# Altium schematic sheet Sheet1.SchDoc: Air Monitor - Draft-1
size 431 x 279 mm; CompanyName: Indian Institute of Technology Hyderabad; DrawnBy: Team; DocumentNumber: 1; Revision: V1; SheetNumber: 1; SheetTotal: 1; Application_BuildNumber: Rev1
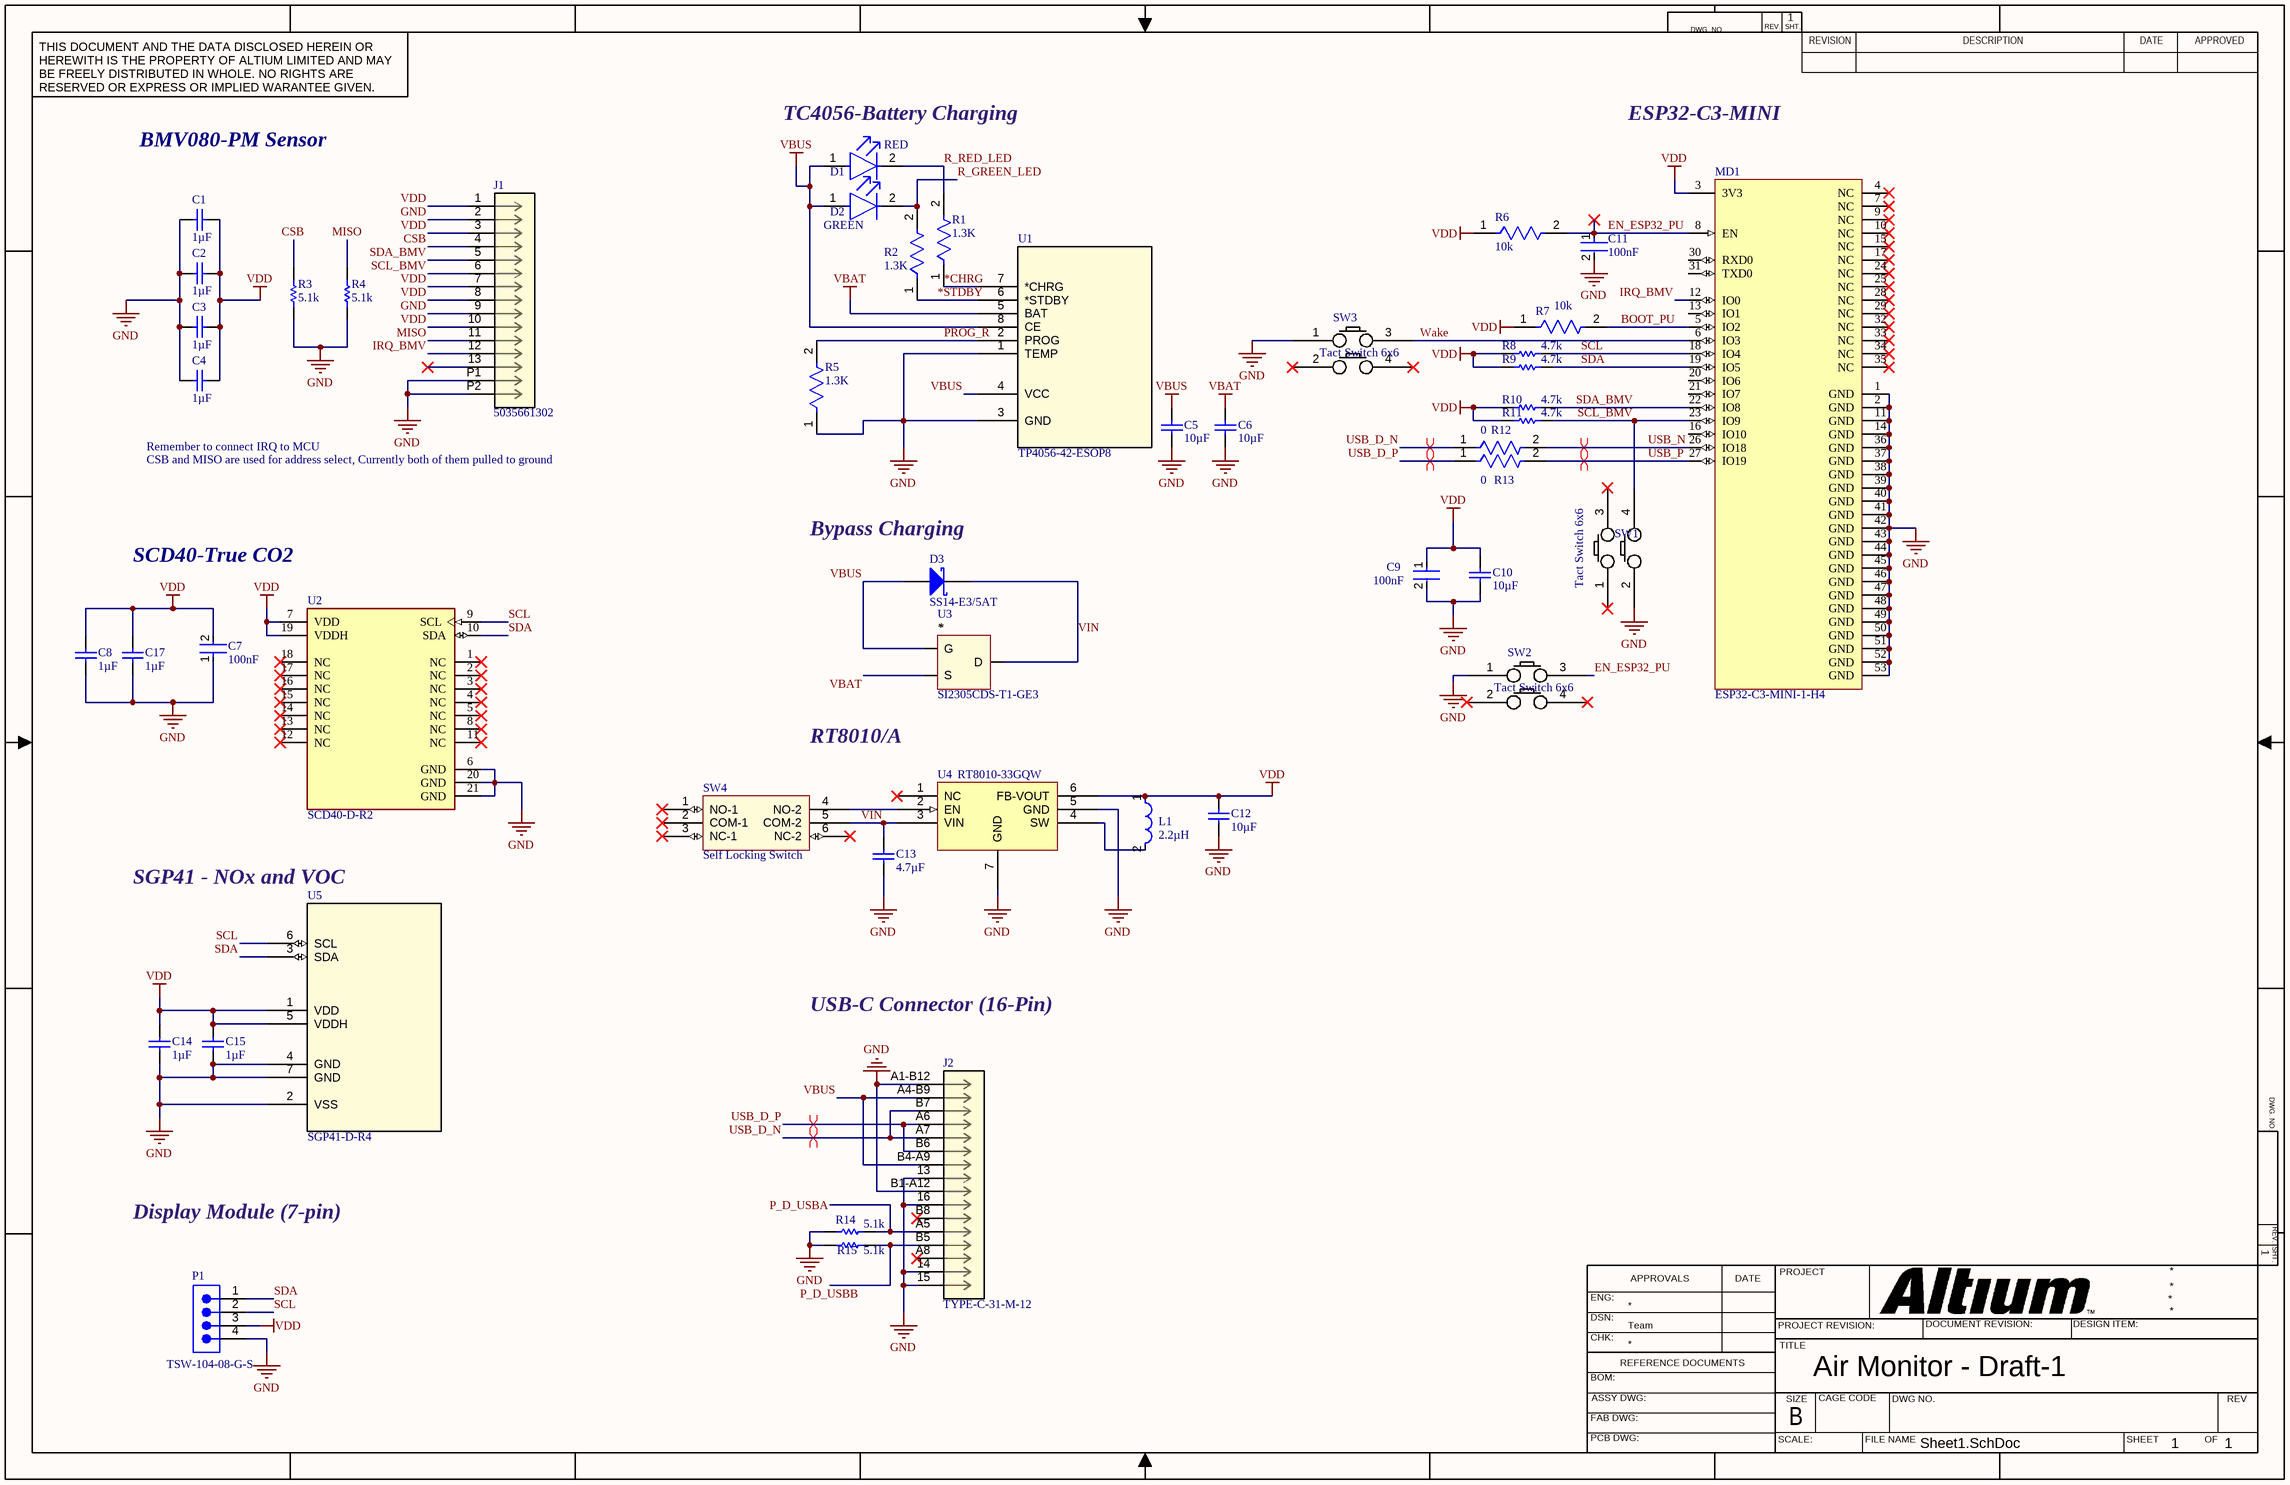
[diagram p0: Sheet1.SchDoc]

## Parts
C1  value 1µF  [CAPC1608X90X35LL15T15]  (hidden comment: C0603C105K4RACTU)
C2  value 1µF  [CAPC1608X90X35LL15T15]  (hidden comment: C0603C105K4RACTU)
C3  value 1µF  [CAPC1608X90X35LL15T15]  (hidden comment: C0603C105K4RACTU)
C4  value 1µF  [CAPC1608X90X35LL15T15]  (hidden comment: C0603C105K4RACTU)
C5  value 10µF  [CAPC2013X140X45LL15T25]  (hidden comment: GRM21BR71A106KE51L)
C6  value 10µF  [CAPC2013X140X45LL15T25]  (hidden comment: GRM21BR71A106KE51L)
C7  value 100nF  [FP-CC0603-DA-IPC_B]  (hidden comment: CC0603KRX7R9BB104)
C8  value 1µF  [CAPC1608X90X35LL15T15]  (hidden comment: C0603C105K4RACTU)
C9  value 100nF  [FP-CC0603-DA-IPC_B]  (hidden comment: CC0603KRX7R9BB104)
C10  value 10µF  [CAPC2013X140X45LL15T25]  (hidden comment: GRM21BR71A106KE51L)
C11  value 100nF  [FP-CC0603-DA-IPC_B]  (hidden comment: CC0603KRX7R9BB104)
C12  value 10µF  [CAPC2013X140X45LL15T25]  (hidden comment: GRM21BR71A106KE51L)
C13  value 4.7µF  [CAPC2013X140X50LL20T25]  (hidden comment: 08053D475KAT2A)
C14  value 1µF  [CAPC1608X90X35LL15T15]  (hidden comment: C0603C105K4RACTU)
C15  value 1µF  [CAPC1608X90X35LL15T15]  (hidden comment: C0603C105K4RACTU)
C17  value 1µF  [CAPC1608X90X35LL15T15]  (hidden comment: C0603C105K4RACTU)
D1  RED  [FP-SM0805YCL-MFG]
D2  GREEN  [FP-SM0805YCL-MFG]
D3  SS14-E3/5AT  [VISH-DO-214AC-2_V]
J1  5035661302  [CON_5035661302_MOL]
J2  TYPE-C-31-M-12  [CONN12_C-31-M-12_HRO]
L1  value 2.2µH  [FP-NR6028-MFG]  (hidden comment: NRS6028T2R2NMGJ)
MD1  ESP32-C3-MINI-1-H4  [FP-ESP32-C3-MINI-1-H4-MFG]
P1  TSW-104-08-G-S  [SMTC-TSW-104-08-X-S]
R1  1.3K  [FP-AC0603-IPC_B]
R2  1.3K  [FP-AC0603-IPC_B]
R3  value 5.1k  [RESC1608X55X25ML10T15]  (hidden comment: RC0603FR-075K1L)
R4  value 5.1k  [RESC1608X55X25ML10T15]  (hidden comment: RC0603FR-075K1L)
R5  1.3K  [FP-AC0603-IPC_B]
R6  value 10k  [FP-RC0603-0_55-IPC_C]  (hidden comment: RC0603FR-0710KL)
R7  value 10k  [FP-RC0603-0_55-IPC_C]  (hidden comment: RC0603FR-0710KL)
R8  value 4.7k  [RESC1608X55X25LL10T15]  (hidden comment: RC0603FR-074K7L)
R9  value 4.7k  [RESC1608X55X25LL10T15]  (hidden comment: RC0603FR-074K7L)
R10  value 4.7k  [RESC1608X55X25LL10T15]  (hidden comment: RC0603FR-074K7L)
R11  value 4.7k  [RESC1608X55X25LL10T15]  (hidden comment: RC0603FR-074K7L)
R12  value 0  [FP-RC0603-MFG]  (hidden comment: RC0603FR-070RL)
R13  value 0  [FP-RC0603-MFG]  (hidden comment: RC0603FR-070RL)
R14  value 5.1k  [RESC1608X55X25ML10T15]  (hidden comment: RC0603FR-075K1L)
R15  value 5.1k  [RESC1608X55X25ML10T15]  (hidden comment: RC0603FR-075K1L)
SW1  Tact Switch 6x6  [Tact Switch 6x6-Footprint-1]
SW2  Tact Switch 6x6  [Tact Switch 6x6-Footprint-1]
SW3  Tact Switch 6x6  [Tact Switch 6x6-Footprint-1]
SW4  Self Locking Switch  [Self Locking Switch-Footprint-1]
U1  TP4056-42-ESOP8  [TP4056-42-ESOP8_TPW]
U2  SCD40-D-R2  [FP-SCD40-D-R2-MFG]
U3  SI2305CDS-T1-GE3  [TO-236_VIS]
U4  RT8010-33GQW  [RT8010-GQW]
U5  SGP41-D-R4  [DFN_SGP41-D-R4_SEN]

## Nets
GND: C1.1 C2.1 C3.1 C4.1 C5.1 C6.1 C7.1 C8.1 C9.2 C10.1 C11.2 C12.1 C13.1 C14.1 C15.1 C17.1 J1.2 J1.9 J1.P1 J1.P2 J2.13 J2.14 J2.15 J2.16 J2.A1-B12 J2.B1-A12 MD1.1(GND) MD1.2(GND) MD1.11(GND) MD1.14(GND) MD1.36(GND) MD1.37(GND) MD1.38(GND) MD1.39(GND) MD1.40(GND) MD1.41(GND) MD1.42(GND) MD1.43(GND) MD1.44(GND) MD1.45(GND) MD1.46(GND) MD1.47(GND) MD1.48(GND) MD1.49(GND) MD1.50(GND) MD1.51(GND) MD1.52(GND) MD1.53(GND) P1.4 R3.1 R4.1 R5.1 R14.1 R15.1 SW1.2(A) SW2.1(A) SW3.1(A) U1.1(TEMP) U1.3(GND) U2.6(GND) U2.20(GND) U2.21(GND) U4.5(GND) U4.7(GND) U5.2(VSS) U5.4(GND) U5.7(GND)
VBAT: C6.2 U1.5(BAT) U3.3(S)
VBUS: C5.2 D1.1(A) D2.1(A) D3.1(A) J2.A4-B9 J2.B4-A9 U1.4(VCC) U1.8(CE) U3.1(G)
VDD: C1.2 C2.2 C3.2 C4.2 C7.2 C8.2 C9.1 C10.2 C12.2 C14.2 C15.2 C17.2 J1.1 J1.3 J1.7 J1.8 J1.10 L1.1 MD1.3(3V3) P1.3 R6.1 R7.1 R8.1 R9.1 R10.1 R11.1 U2.7(VDD) U2.19(VDDH) U4.6(FB-VOUT) U5.1(VDD) U5.5(VDDH)
*CHRG: R1.1 U1.7(*CHRG)
*STDBY: R2.1 U1.6(*STDBY)
BOOT_PU: MD1.5(IO2) R7.2
CSB: J1.4 R3.2
EN_ESP32_PU: C11.1 MD1.8(EN) R6.2 SW2.3(B)
IRQ_BMV: J1.12 MD1.12(IO0)
MISO: J1.11 R4.2
P_D_USBA: J2.A5 R14.2
P_D_USBB: J2.B5 R15.2
PROG_R: R5.2 U1.2(PROG)
R_GREEN_LED: D2.2(C) R2.2
R_RED_LED: D1.2(C) R1.2
SCL: MD1.18(IO4) P1.2 R8.2 U2.9(SCL) U5.6(SCL)
SCL_BMV: J1.6 MD1.23(IO9) R11.2 SW1.4(B)
SDA: MD1.19(IO5) P1.1 R9.2 U2.10(SDA) U5.3(SDA)
SDA_BMV: J1.5 MD1.22(IO8) R10.2
USB_D_N: J2.A7 J2.B7 R12.1
USB_D_P: J2.A6 J2.B6 R13.1
USB_N: MD1.26(IO18) R12.2
USB_P: MD1.27(IO19) R13.2
VIN: C13.2 D3.2(K) SW4.5(COM-2) U3.2(D) U4.3(VIN)
Wake: MD1.6(IO3) SW3.3(B)
NetL1_2: L1.2 U4.4(SW)
NetSW4_4: SW4.4(NO-2) U4.2(EN)

Not connected (* = marked no-connect by the designer): J1 13*; J2 A8* B8*; MD1 4(NC)* 7(NC)* 9(NC)* 10(NC)* 13(IO1) 15(NC)* 16(IO10) 17(NC)* 20(IO6) 21(IO7) 24(NC)* 25(NC)* 28(NC)* 29(NC)* 30(RXD0) 31(TXD0) 32(NC)* 33(NC)* 34(NC)* 35(NC)*; SW1 1(A)* 3(B)*; SW2 2(A)* 4(B)*; SW3 2(A)* 4(B)*; SW4 1(NO-1)* 2(COM-1)* 3(NC-1)* 6(NC-2)*; U2 1(NC)* 2(NC)* 3(NC)* 4(NC)* 5(NC)* 8(NC)* 11(NC)* 12(NC)* 13(NC)* 14(NC)* 15(NC)* 16(NC)* 17(NC)* 18(NC)*; U4 1(NC)*

## Layout directives
differential pair: USB_D_N, USB_D_P, USB_N, USB_P

## Notes on the sheet
- BMV080-PM Sensor
- (near D1) TC4056-Battery Charging
- ESP32-C3-MINI
- Remember to connect IRQ to MCU
- CSB and MISO are used for address select, Currently both of them pulled to ground
- SCD40-True CO2
- (near D3) Bypass Charging
- RT8010/A
- SGP41 - NOx and VOC
- USB-C Connector (16-Pin)
- Display Module (7-pin)
- DWG. NO.
- REV.
- SHT.
- THIS DOCUMENT AND THE DATA DISCLOSED HEREIN OR HEREWITH IS THE PROPERTY OF ALTIUM LIMITED AND MAY BE FREELY DISTRIBUTED IN WHOLE. NO RIGHTS ARE RESERVED OR EXPRESS OR IMPLIED WARANTEE GIVEN.
- REVISION
- DESCRIPTION
- DATE
- APPROVED
- ENG:
- APPROVALS
- PROJECT
- DSN:
- CHK:
- REFERENCE DOCUMENTS
- PROJECT REVISION:
- TITLE
- DOCUMENT REVISION:
- DESIGN ITEM:
- BOM:
- FAB DWG:
- PCB DWG:
- ASSY DWG:
- SCALE:
- SIZE
- B
- CAGE CODE
- FILE NAME
- DWG NO.
- SHEET
- OF
- REV

## Library data of the parts
C1-C4 C8 C14 C15 C17 = CMP-001-00093-1: 16V 1uF X7R ±10% 0603 Multilayer Ceramic Capacitors MLCC - SMD/SMT ROHS; Dissipation Factor: 3.5%; Depth: 800µm; Dielectric Material: Ceramic; Mounting Technology: Surface Mount; Export Control Classification Number (ECCN) Code: EAR99; REACH SVHC: Yes; Max Operating Temperature: 125°C; Packaging: Cut Tape; Contact Plating: Tin; Dielectric: X7R; RoHS: Compliant; Material: Ceramic; Schedule B: 8532240020, 8532240020; Tolerance: 10%; Case Code (Metric): 1608; Thickness: 889µm; Voltage Rating: 16V; Length: 1.6mm; Voltage Rating (DC): 16V; Radiation Hardening: No; Lifecycle Status: Production; Width: 800µm; Pins: 2; Country of Origin: Mexico; Min Operating Temperature: -55°C; Introduction Date: 2008-12-01; Termination: SMD/SMT; China RoHS: Compliant; Number of Terminals: 2; Height: 800µm; Case Code (Imperial): 0603; Voltage: 16V; Harmonized Tariff Schedule (HTS) Code: 8532.24.00.20; Case/Package: 0603
C5 C6 C10 C12 = CMP-001-00091-1: Multilayer Ceramic Capacitor, 10 uF, 10 V, ± 10%, X7R, 0805 [2012 Metric]; Manufacturer Lifecycle Status: TO BE DISCONTINUED; Voltage Rating: 10V; Termination: SMD/SMT; Country of Origin: Philippines; Case Code (Metric): 2012; Pins: 2; Case Code (Imperial): 0805; Dielectric Material: Ceramic; REACH SVHC: Yes; Introduction Date: 2006-06-22; Width: 1.25mm; Lead Free: Lead Free; Number of Terminals: 2; RoHS: Compliant; Lifecycle Status: EOL; Tolerance: 10%; Depth: 1.25mm; Height: 1.25mm; Harmonized Tariff Schedule (HTS) Code: 8532.24.00.20; Voltage: 10V; Schedule B: 8532240020; Case/Package: 0805; Voltage Rating (DC): 10V; Min Operating Temperature: -55°C; Mounting Technology: Surface Mount; Thickness: 1.25mm; Length: 2mm; Max Operating Temperature: 125°C; Export Control Classification Number (ECCN) Code: EAR99; Dielectric: X7R
C7 C9 C11 = CMP-001-00092-1: Multilayer Ceramic Capacitor, CC Series, 0.1 - F, - 10%, X7R, 50 V, 0603 [1608 Metric]; Voltage Rating (DC): 50V; Max Operating Temperature: 125°C; Country of Origin: Mainland China, Taiwan; Voltage Rating: 50V; Depth: 800µm; Harmonized Tariff Schedule (HTS) Code: 8532.24.00.20; Length: 1.6mm; Lifecycle Status: Production; Case/Package: 0603; Min Operating Temperature: -55°C; Material: Ceramic; Thickness: 889µm; Number of Terminals: 2; Pins: 2; Schedule B: 8532240020, 8532240020; Dielectric: X7R; Radiation Hardening: No; Dielectric Material: Ceramic; Export Control Classification Number (ECCN) Code: EAR99; Case Code (Metric): 1608; Height: 800µm; RoHS: Compliant; Mounting Technology: Surface Mount; REACH SVHC: Yes; Width: 800µm; China RoHS: Compliant; Halogen Free: Halogen Free; Voltage: 50V; Tolerance: 10%; Introduction Date: 2005-08-18; Lead Free: Lead Free; Case Code (Imperial): 0603; Termination: SMD/SMT
C13 = CMP-001-00094-1: 0805 Standard 4.7UF Ceramic Multilayer Cap, 25V DC, +85C, X5R Dielectric, +/-10% SMD; Tolerance: 10%; Introduction Date: 2005-08-15; Voltage: 25V; Case/Package: 0805; REACH SVHC: Yes; Harmonized Tariff Schedule (HTS) Code: 8532.24.00.20; Length: 2.01mm; Packaging: Cut Tape; Case Code (Metric): 2012; Max Operating Temperature: 85°C; Dielectric Material: Ceramic; Radiation Hardening: No; Material: Ceramic; Width: 1.25mm; Number of Terminals: 2; Voltage Rating (DC): 25V; Pins: 2; Termination: SMD/SMT; Lifecycle Status: Production; Dielectric: X5R; Mounting Technology: Surface Mount; Min Operating Temperature: -55°C; RoHS: Compliant; Lead Free: Lead Free; Export Control Classification Number (ECCN) Code: EAR99; Schedule B: 8532240020; Voltage Rating: 25V; Contact Plating: Tin; Case Code (Imperial): 0805; Height: 1.4mm; China RoHS: Compliant; Depth: 1.25mm; Thickness: 1.397mm
D1 D2 = CMP-35283-000007-1: LED YELLOW CLEAR 0805 SMD; Luminous Intensity: 11.5mcd; Test Current: 2mA; Viewing Angle: 130°; Dominant Wavelength: 592nm; Forward Voltage: 1.9V; Lens Color: Colorless; Case Code (Metric): 2012; Illumination Color: Yellow; Length: 2mm; Max Operating Temperature: 80°C; Width: 1.2mm; Case Code (Imperial): 0805; Packaging: Tape and Reel; Lens Transparency: Clear; Mount: Surface Mount; Case/Package: 0805; Forward Current: 2mA; Height: 0.8mm; Lead Free: Lead Free; Min Operating Temperature: -30°C; Color: Yellow; Package Quantity: 4000
D3 = CMP-004-00031-1: Rectifier Diode, Schottky, 1 Phase, 1 Element, 1A, 40V V(RRM), Silicon, DO-214AC; Peak Reverse Current: 200µA; Element Configuration: Single; Max Surge Current: 40A; Number of Elements: 1; Forward Voltage: 500mV; Contact Plating: Tin; Lifecycle Status: Production; Country of Origin: Mainland China; Lead Free: Lead Free; Min Operating Temperature: -65°C; Max Output current: 1A; Schedule B: 8541100080, 8541100080; Radiation Hardening: No; Length: 4.6mm; Max Reverse Leakage Current: 200µA; Pins: 2; Max Reverse Voltage (DC): 40V; Max Forward Surge Current (Ifsm): 40A; Average Rectified Current: 1A; Harmonized Tariff Schedule (HTS) Code: 8541.10.00.80; Mounting Technology: Surface Mount; Case/Package: SMA; RoHS: Compliant; Width: 2.9mm; China RoHS: Non-Compliant; Max Repetitive Reverse Voltage (Vrrm): 40V; Number of Terminals: 2; Forward Current: 1A; Peak Non-Repetitive Surge Current: 40A; Export Control Classification Number (ECCN) Code: EAR99; Packaging: Cut Tape; Introduction Date: 2006-05-29; Max Operating Temperature: 150°C; Reverse Standoff Voltage: 40V; REACH SVHC: No
J1 = CMP-002-00080-1: Easy-On FPC Connector, 0.30mm Pitch, Right-Angle, Bottom Contact, 0.95mm  Height, 13 Circuits, Gold over Nickel Plating; Manufacturer_Name: Molex Connector Corporation; Design Item ID: 5035661302; Type: Type; Source: 5035661302.SchLib; Manufacturer_Part_Number: 5035661302; RefDes: RefDes; Copyright: Copyright (C) 2026 Ultra Librarian. All rights reserved.
J2 = CMP-002-00081-1: Description; Manufacturer_Name: HRO Electronics; Type: Type; RefDes: RefDes; Copyright: Copyright (C) 2025 Ultra Librarian. All rights reserved.; Source: TYPE-C-31-M-12.SchLib; Design Item ID: TYPE-C-31-M-12; Manufacturer_Part_Number: TYPE-C-31-M-12
L1 = CMP-006-00021-1: Inductor Power Shielded Wirewound 2.2uH 30% 100KHz Ferrite 3.7A 0.026Ohm DCR 2424 T/R; Max Saturation Current: 4.2A; Shielding: Unshielded; Self Resonant Frequency: 68MHz; Number of Circuits: 1; DC Resistance (DCR): 26mΩ; Depth: 6.2mm; Max DC Current: 3.7A; Lead Free: Lead Free; Height: 2.8mm; Number of Terminals: 2; Introduction Date: 2010-08-25; Mounting Technology: Surface Mount; Length: 6mm; Max Current Rating: 3.7A; RoHS: Compliant; Composition: Wirewound; Radiation Hardening: No; Inductance Tolerance: 30%; Max Temperature Rise Current: 3.7A; Temperature Rise Current: 4.2A; Test Frequency: 100kHz; REACH SVHC: Yes; Lifecycle Status: Production; Case/Package: 2424; Min Operating Temperature: -25°C; Max Width: 6.2mm; Tolerance: 30%; Termination: SMD/SMT; Lead Pitch: 4.7mm; Min Width: 5.8mm; Height - Seated (Max): 2.794mm; Saturation Current: 4.2A; Min Length: 5.8mm; Export Control Classification Number (ECCN) Code: EAR99; Max Operating Temperature: 125°C; Max Length: 6.2mm; Halogen Free: Halogen Free; RMS Current (Irms): 3.7A; Pins: 2; Width: 6mm; Current Rating: 3.7A; Harmonized Tariff Schedule (HTS) Code: 8504.50.80.00; ESR: 26mΩ; Core Material: Ferrite
MD1 = CMP-020-00024-1: -96dBm 20.5dBm PCBAntenna 2.4GHz SMD, 13.2x16.6mm WiFi Modules ROHS; Operating Supply Voltage: 3.3V; Interface: SPI; Number of GPIO: 13; Clock Frequency: 2.484GHz; Data Rate: 150Mbps; Current - Receiving: 84mA; Min Supply Voltage: 3V; Max Supply Voltage: 3.6V; Current - Transmitting: 350mA; Number of Terminals: 53; Max Operating Temperature: 105°C; Length: 16.6mm; Contact Plating: Gold; Harmonized Tariff Schedule (HTS) Code: 8542.31.00.30; Height: 2.55mm; Height - Seated (Max): 2.55mm; RoHS: Compliant; Min Operating Temperature: -40°C; Width: 13.2mm; REACH SVHC: No; Ambient Temperature Range High: 85°C; Terminal Pitch: 800µm
P1 = CMP-1024-00357-1: 0.025" SQ Post Header, Through-hole, Vertical, -55 to 125 degC, 2.54 mm Pitch, 4-Pin, Male, RoHS; Manufacturer: Samtec; Pitch: 2.54 mm; RoHS: True; ComponentLink3URL: http://www.samtec.com/documents/webfiles/cpdf/TSW-XXX-XX-XXX-X-XX-XXX-MKT.pdf; Mounting Technology: Through-hole; ComponentLink2URL: http://www.samtec.com/documents/webfiles/pdf/TSW_TH.PDF; ComponentLink1URL: http://www.samtec.com; ComponentLink3Description: Package Specification; PackageVersion: DM, 8/1988; ComponentLink2Description: Datasheet; PackageReference: TSW-104-08-X-S; PackageDescription: .025[0.64] SQ. Post Terminal Strip Assembly; PartNumber: TSW-104-08-G-S; ComponentLink1Description: Manufacturer URL; Temperature Range: -55 to 125 degC; DatasheetVersion: F-214; Orientation: Vertical
R1 R2 R5 = CMP-2000-04825-3: RES 1.3KΩ 1.00% 0.1W 0603; Tolerance: 1%; Temperature Coefficient: 100ppm/°C; Voltage Rating: 50V; Resistance: 1.3kR; Max Power Dissipation: 100mW; Max Operating Temperature: 155°C; Case Code (Metric): 1608; RoHS Compliant: Yes; Height: 0.022inch; Case/Package: 0603; Resistor Type: Thick Film; Termination: SMD/SMT; Series: AC; Military Standard: Not; Construction: Rectangular; Case Code (Imperial): 0603; Number of Terminations: 2; Packaging: Tape and Reel; Depth: 0.8mm; Length: 1.6mm; Min Operating Temperature: -55°C; Features: Moisture Resistant; Power Rating: 100mW; Width: 0.8mm
R3 R4 R14 R15 = CMP-009-00189-1: Res Thick Film 0603 5.1K Ohm 1% 0.1W(1/10W) ±100ppm/C Pad SMD T/R; Power Rating: 100mW; Temperature Coefficient: 100ppm/°C; Voltage Rating (DC): 50V; Working Voltage: 75V; Packaging: Tape & Reel; REACH SVHC: Yes; Mounting Technology: Surface Mount; Composition: Thick Film; Case/Package: 0603; Power Dissipation: 100mW; Case Code (Imperial): 0603; Width: 800µm; Features: Moisture Resistant; Number of Terminations: 2; Military Standard: Not; Schedule B: 8533210045, 8533210045; Pins: 2; Min Operating Temperature: -55°C; Max Power Dissipation: 100mW; Lifecycle Status: Production; China RoHS: Non-Compliant; Termination: SMD/SMT; Tolerance: 1%; RoHS: Compliant; Height: 450µm; Max Operating Temperature: 155°C; Number of Terminals: 2; Depth: 800µm; Lead Free: Lead Free; Voltage Rating: 75V
R6 R7 = CMP-009-00187-1: 100mW Thick Film Resistors ±100ppm/℃ ±1% 10kΩ 0603 Chip Resistor - Surface Mount ROHS; Voltage Rating: 75V; Temperature Coefficient: 100ppm/°C; Voltage Rating (DC): 50V; Military Standard: Not; Weight: 2.012816mg; Depth: 800µm; Number of Terminals: 2; Tolerance: 1%; China RoHS: Non-Compliant; Min Operating Temperature: -55°C; Pins: 2; Case Code (Imperial): 0603; Power Rating: 100mW; Lifecycle Status: Production; Max Operating Temperature: 155°C; Lead Pitch: 300µm; Width: 800µm; REACH SVHC: Yes; Length: 1.6mm; Packaging: Tape & Reel; Composition: Thick Film; Case/Package: 0603; Lead Free: Lead Free; Schedule B: 8533210045, 8533210045; Mounting Technology: Surface Mount; Height: 450µm; Working Voltage: 75V; Termination: SMD/SMT; Case Code (Metric): 0603; Power Dissipation: 100mW; RoHS: Compliant
R8-R11 = CMP-009-00190-1: Res Thick Film 1.6 x 0.8 mm 4.7K Ohm 1% 0.1W(1/10W) 100ppm/ C Molded SMD Paper T/R; Working Voltage: 75V; Power Rating: 100mW; Voltage Rating (DC): 50V; Temperature Coefficient: 100ppm/°C; RoHS: Compliant; Introduction Date: 2004-09-22; Pins: 2; Export Control Classification Number (ECCN) Code: EAR99; Composition: Thick Film; REACH SVHC: Yes; Lead Pitch: 300µm; Length: 1.6mm; Military Standard: Not; Country of Origin: Mainland China, Taiwan; Min Operating Temperature: -55°C; Termination: SMD/SMT; Harmonized Tariff Schedule (HTS) Code: 8533.21.00.30; Lead Free: Lead Free; Case/Package: 0603; Width: 800µm; Packaging: Tape & Reel; China RoHS: Non-Compliant; Case Code (Imperial): 0603; Schedule B: 8533210045, 8533210045; Number of Terminals: 2; Mounting Technology: Surface Mount; Tolerance: 1%; Height: 450µm; Lifecycle Status: Production; Power Dissipation: 100mW; Max Operating Temperature: 155°C; Depth: 800µm; Voltage Rating: 75V
R12 R13 = CMP-009-00188-1: Zero Ohm Resistor, Jumper, 0603 [1608 Metric], Thick Film, 100 mW, 1 A, Surface Mount; Tolerance: 1%; Voltage Rating: 75V; Voltage Rating (DC): 50V; Max Power Dissipation: 100mW; Temperature Coefficient: 200ppm/°C; Current Rating: 1A; Min Operating Temperature: -55°C; China RoHS: Non-Compliant; Case Code (Imperial): 0603; Width: 800µm; REACH SVHC: Yes; Case/Package: 0603; RoHS: Compliant; Number of Terminals: 2; Schedule B: 8533210045, 8533210045; Lead Free: Lead Free; Pins: 2; Lifecycle Status: Production; Working Voltage: 75V; Composition: Thick Film; Features: Moisture Resistant; Power Dissipation: 100mW; Packaging: Tape & Reel; Radiation Hardening: No; Number of Terminations: 2; Depth: 800µm; Height: 450µm; Military Standard: Not; Contact Plating: Tin; Power Rating: 100mW; Max Operating Temperature: 155°C; Mounting Technology: Surface Mount; Termination: SMD/SMT; Length: 1.6mm
SW1-SW3 = CMP-011-00016-4: Tact switch- 6x6mm
SW4 = CMP-011-00015-2: A self locking-latch like switch.; Current Rating: 500mA; Voltage Rating: 250V; Pins: 6; Max Current Rating: 500mA
U1 = CMP-009-000000-1: Description; Manufacturer_Name: TOPPOWER; Design Item ID: TP4056-42-ESOP8; Source: TP4056-42-ESOP8.SchLib; Manufacturer_Part_Number: TP4056-42-ESOP8; Type: Type; Copyright: Copyright (C) 2026 Ultra Librarian. All rights reserved.; RefDes: RefDes
U2 = CMP-010-00024-1: Air Quality Sensor CO2 Sensor 2.5V/3.3V/5V 20-Pin SMD EP T/R; Output Configuration: Digital; Max Supply Voltage: 5.5V; Min Supply Voltage: 2.4V; Lifecycle Status: Production; Length: 10.1mm; Height: 5.5mm; Min Operating Temperature: -10°C; REACH SVHC: Yes; Schedule B: 9031808080; RoHS: Compliant; Max Operating Temperature: 60°C; Mounting Technology: Surface Mount; Number of Terminals: 21
U3 = CMP-013-00038-1: P-CHANNEL 8-V (D-S) MOSFET; Manufacturer_Name: Vishay; Source: SI2305CDS-T1-GE3.SchLib; Manufacturer_Part_Number: SI2305CDS-T1-GE3; Design Item ID: SI2305CDS-T1-GE3; Copyright: Copyright (C) 2025 Ultra Librarian. All rights reserved.
U4 = CMP-019-00056-1: Switching Regulator, Voltage-mode, 1A, 1800kHz Switching Freq-Max, PDSO6; Max Supply Voltage: 5.5V; Switching Frequency: 1.5MHz; Min Input Voltage: 2.5V; Max Switching Frequency: 1.8MHz; Output Type: Fixed; Output Current: 1A; Max Operating Temperature: 85°C; Min Operating Temperature: -40°C; Mounting Technology: Surface Mount; Number of Terminals: 6; Temperature Grade: Industrial; Max Output current: 1A
U5 = CMP-003-000000-2: NOx and VOC Sensor with a Secondary Humidity and Temperature Output; Manufacturer_Name: Sensirion; Source: SGP41-D-R4.SchLib; RefDes: RefDes; Manufacturer_Part_Number: SGP41-D-R4; Copyright: Copyright (C) 2026 Ultra Librarian. All rights reserved.; Design Item ID: SGP41-D-R4; Type: Type